# Altium schematic sheet isoSPI.SchDoc: isoSPI Interface
size Letter; Engineer: Nathan Petersen; DocumentNumber: 20; SheetNumber: 20; SheetTotal: 25
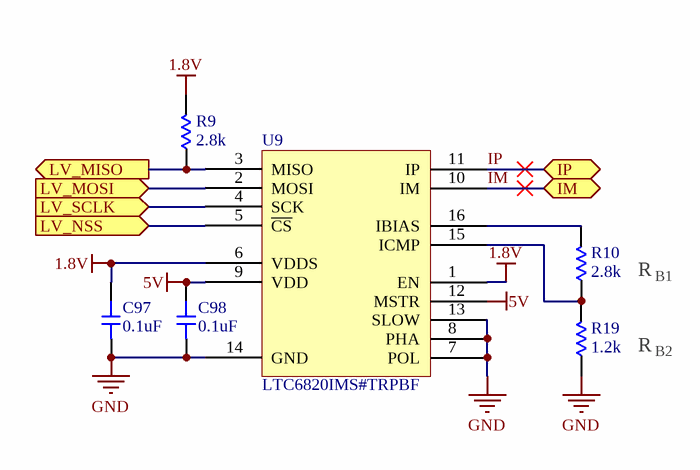
[diagram p0: isoSPI.SchDoc]

## Parts
C97  value 0.1uF  [0603-CAP]  (hidden comment: Capacitor)
C98  value 0.1uF  [0603-CAP]  (hidden comment: Capacitor)
R9  value 2.8k  [0603-RES]  (hidden comment: Resistor)
R10  value 2.8k  [0603-RES]  (hidden comment: Resistor)
R19  value 1.2k  [0603-RES]  (hidden comment: Resistor)
U9  LTC6820IMS#TRPBF  [TSSOP50P490X110-16N]

## Ports
IM (bidir), IP (bidir), LV_MISO (out), LV_MOSI (in), LV_NSS (in), LV_SCLK (in)

## Nets
1.8V: C97.2 R9.2 U9.1(EN) U9.6(VDDS)
5V: C98.2 U9.9(VDD) U9.12(MSTR)
GND: C97.1 C98.1 R19.1 U9.7(POL) U9.8(PHA) U9.13(SLOW) U9.14(GND)
IM: U9.10(IM) ; port IM
IP: U9.11(IP) ; port IP
LV_MISO: R9.1 U9.3(MISO) ; port LV_MISO
LV_MOSI: U9.2(MOSI) ; port LV_MOSI
LV_NSS: U9.5(~{CS}) ; port LV_NSS
LV_SCLK: U9.4(SCK) ; port LV_SCLK
NetR10_1: R10.1 R19.2 U9.15(ICMP)
NetR10_2: R10.2 U9.16(IBIAS)

## Notes on the sheet
- R
- B1
- B2
- Title:
- File:
- Sheet:
- of
- Revision:
- Time:
- Date:
- Engineer:

## Library data of the parts
U9 = LTC6820IMS#TRPBF: IC INTERFACE SPECIALIZED 16MSOP; Supplier 1: Digi-Key; Supplier Part Number 1: LTC6820IMS#TRPBFCT-ND
C97 C98 = Capacitor: Supplier 1: Digi-Key; Supplier Part Number 1: 1276-1012-6-ND
R9 R10 R19 = Resistor: Supplier 1: Digi-Key
  R9 R10: Supplier Part Number 1: 311-2.80KHRCT-ND
  R19: Supplier Part Number 1: 311-1.20KHRCT-ND